# EAGLE design PC_CurveTracer (EAGLE 7.5.0)
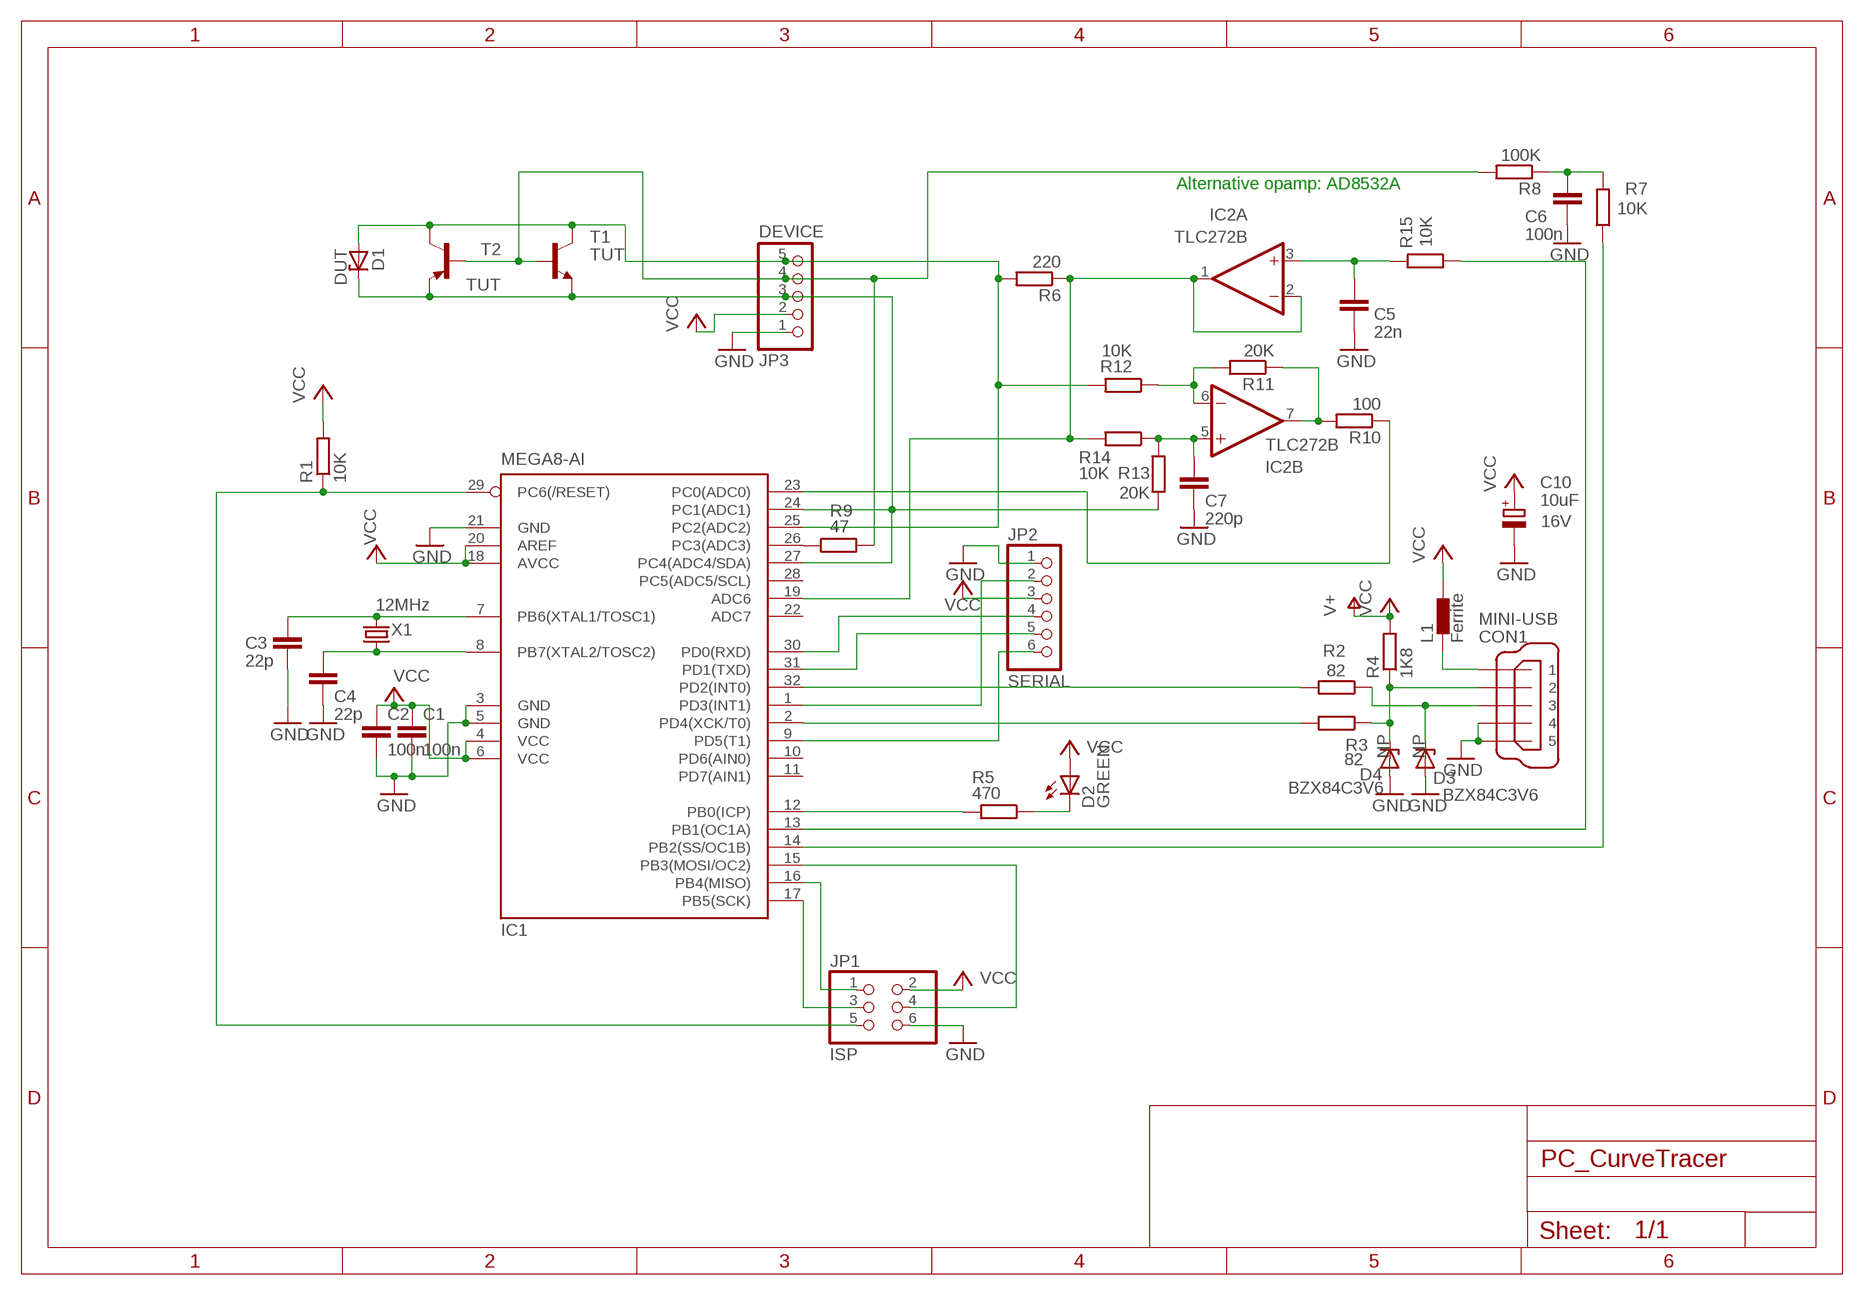
[diagram p0: schematic, sheet 1]

## Parts
C1  100n  C-EUC1206  [C1206]
C2  100n  C-EUC1206  [C1206]
C3  22p  C-EUC0603  [C0603]
C4  22p  C-EUC0603  [C0603]
C5  22n  C-EUC1206  [C1206]
C6  100n  C-EUC1206  [C1206]
C7  220p  C-EUC1206  [C1206]
C10  10uF  CPOL-EUSMCC  [SMC_C]
CON1  MINI-USB  MINI-USB_SHIELD5P4-32005-400  [32005-400]
D1  DUT  ZENER-DIODESOD80C  [SOD80C]
D2  GREEN  LEDSML0805  [SML0805]
D3  BZX84C3V6  BZX84CSMD  [TO236]
D4  BZX84C3V6  BZX84CSMD  [TO236]
IC1  MEGA8-AI  [TQFP32-08]
IC2  TLC272B  LM358D  [SO08]
JP1  ISP  PINHD-2X3  [2X03]
JP2  SERIAL  PINHD-1X6  [1X06]
JP3  DEVICE  PINHD-1X5  [1X05]
L1  Ferrite  BLM15HG601SN1  [0402]
R1  10K  R-EU_R1206  [R1206]
R2  82  R-EU_R1206  [R1206]
R3  82  R-EU_R1206  [R1206]
R4  1K8  R-EU_R1206  [R1206]
R5  470  R-EU_R1206  [R1206]
R6  220  R-EU_R1206  [R1206]
R7  10K  R-EU_R1206  [R1206]
R8  100K  R-EU_R1206  [R1206]
R9  47  R-EU_R1206  [R1206]
R10  100  R-EU_R1206  [R1206]
R11  20K  R-EU_R1206  [R1206]
R12  10K  R-EU_R1206  [R1206]
R13  20K  R-EU_R1206  [R1206]
R14  10K  R-EU_R1206  [R1206]
R15  10K  R-EU_R1206  [R1206]
T1  TUT  BC846  [SOT23]
T2  TUT  -PNP-SOT89-ECB  [SOT89-ECB]
X1  12MHz  CRYSTALHC49S  [HC49/S]

## Nets
GND: C1.2 C2.2 C3.2 C4.2 C5.2 C6.2 C7.2 C10.- CON1.4 CON1.5 D3.A D4.A IC1.3(GND) IC1.5(GND) IC1.21(GND) JP1.6 JP2.1 JP3.1
N$1: IC1.29(PC6(/RESET)) JP1.5 R1.1
N$2: D2.C R5.1
N$3: C3.1 IC1.7(PB6(XTAL1/TOSC1)) X1.2
N$4: C4.1 IC1.8(PB7(XTAL2/TOSC2)) X1.1
N$5: IC1.16(PB4(MISO)) JP1.1
N$6: CON1.1 L1.1
N$7: IC1.15(PB3(MOSI/OC2)) JP1.4
N$8: IC1.12(PB0(ICP)) R5.2
N$9: IC1.32(PD2(INT0)) R2.2
N$10: IC1.1(PD3(INT1)) JP2.2
N$11: CON1.3 D3.C R2.1
N$12: IC1.30(PD0(RXD)) JP2.4
N$13: IC1.2(PD4(XCK/T0)) R3.2
N$14: CON1.2 D4.C R3.1 R4.1
N$15: IC1.13(PB1(OC1A)) R15.1
N$16: C6.1 R7.2 R8.1
N$17: IC2.6(B:-IN) R11.2 R12.1
N$18: IC1.31(PD1(TXD)) JP2.5
N$19: D1.C IC1.24(PC1(ADC1)) IC1.27(PC4(ADC4/SDA)) JP3.3 R13.1 T1.2(E) T2.E
N$21: IC1.9(PD5(T1)) JP2.6
N$22: IC1.23(PC0(ADC0)) R10.1
N$23: IC1.26(PC3(ADC3)) R9.1
N$24: IC1.19(ADC6) IC2.1(A:OUT) IC2.2(A:-IN) R6.1 R14.2
N$25: IC2.7(B:OUT) R10.2 R11.1
N$28: IC1.14(PB2(SS/OC1B)) R7.1
N$33: D1.A IC1.25(PC2(ADC2)) JP3.5 R6.2 R12.2 T1.3(C) T2.C
N$34: C7.1 IC2.5(B:+IN) R13.2 R14.1
N$37: IC1.17(PB5(SCK)) JP1.3
N$41: C5.1 IC2.3(A:+IN) R15.2
TUT: JP3.4 R8.2 R9.2 T1.1(B) T2.B
VCC: C1.1 C2.1 C10.+ D2.A IC1.4(VCC) IC1.6(VCC) IC1.18(AVCC) IC1.20(AREF) JP1.2 JP2.3 JP3.2 L1.2 R1.2 R4.2 ; supply symbol labelled V+
Unconnected: CON1.M1(S1) CON1.M2(S2) CON1.M3(S3) CON1.M4(S4) IC1.10(PD6(AIN0)) IC1.11(PD7(AIN1)) IC1.22(ADC7) IC1.28(PC5(ADC5/SCL))

## Notes on the sheet
- Alternative opamp: AD8532A

## Power pins joined to a net without a drawn wire
GND: IC2.4(P:GND)
VCC: IC2.8(P:VCC)

## Library data of the parts
C1-C7 = rcl:C-EU: CAPACITOR, European symbol
C10 = rcl:CPOL-EU: POLARIZED CAPACITOR, European symbol; VOLTAGE: 16V
CON1 = con-cypressindustries:MINI-USB_SHIELD5P4-: MINI USB-B R/A W/O POST 5 pol. Source: www.cypressindustries.com; OC_FARNELL: unknown; OC_NEWARK: unknown
D1 = diode:ZENER-DIODE: Z-Diode
D2 = led:LED: LED OSRAM: - CHIPLED LG R971, LG N971, LY N971, LG Q971, LY Q971, LO R971, LY R971 LH N974, LH R974 LS Q976, LO Q976, LY Q976 LO Q996 - Hyper CHIPLED LW Q18S LB Q993, LB Q99A, LB R99A - SideLED LS A670, LO A670, LY A670, LG A670, LP A670 LB A673, LV A673, LT A673, LW A673 LH A674 LY A675 LS A676, LA A676, LO A676, LY A676, LW A676 LS A679, LY A679, LG A679 - Hyper Micro SIDELED® LS Y876, LA Y876, LO Y876, LY Y876 LT Y87S - SmartLED LW L88C, LW L88S LB L89C, LB L89S, LG L890 LS L89K, LO L89K, LY L89K LS L896, LA L896, LO L896, LY L896 - TOPLED LS T670, LO T670, LY T670, LG T670, LP T670 LSG T670, LSP T670, LSY T670, LOP T670, LYG T670 LG T671, LOG T671, LSG T671 LB T673, LV T673, LT T673, LW T673 LH T674 LS T676, LA T676, LO T676, LY T676, LB T676, LH T676, LSB T676, LW T676 LB T67C, LV T67C, LT T67C, LS T67K, LO T67K, LY T67K, LW E67C LS E67B, LA E67B, LO E67B, LY E67B, LB E67C, LV E67C, LT E67C LW T67C LS T679, LY T679, LG T679 LS T770, LO T770, LY T770, LG T770, LP T770 LB T773, LV T773, LT T773, LW T773 LH T774 LS E675, LA E675, LY E675, LS T675 LS T776, LA T776, LO T776, LY T776, LB T776 LHGB T686 LT T68C, LB T68C - Hyper Mini TOPLED® LB M676 - Mini TOPLED Santana® LG M470 LS M47K, LO M47K, LY M47K Source: http://www.osram.convergy.de LUXEON: - LUMILED® LXK2-PW12-R00, LXK2-PW12-S00, LXK2-PW14-U00, LXK2-PW14-V00 LXK2-PM12-R00, LXK2-PM12-S00, LXK2-PM14-U00 LXK2-PE12-Q00, LXK2-PE12-R00, LXK2-PE12-S00, LXK2-PE14-T00, LXK2-PE14-U00 LXK2-PB12-K00, LXK2-PB12-L00, LXK2-PB12-M00, LXK2-PB14-N00, LXK2-PB14-P00, LXK2-PB14-Q00 LXK2-PR12-L00, LXK2-PR12-M00, LXK2-PR14-Q00, LXK2-PR14-R00 LXK2-PD12-Q00, LXK2-PD12-R00, LXK2-PD12-S00 LXK2-PH12-R00, LXK2-PH12-S00 LXK2-PL12-P00, LXK2-PL12-Q00, LXK2-PL12-R00 Source: www.luxeon.com KINGBRIGHT: KA-3528ASYC Source: www.kingbright.com
D3 D4 = diode:BZX84CSMD: Z DIODE; NP: NP
IC1 = atmel:MEGA8: MICROCONTROLLER 8 Kbytes FLASH, 1 kbytes SRAM, 512 bytes EEPROM, USART, 6-channel 10 bit ADC, 2-channel 8 bit ADC Pin compatible with Atmega48, ATMega88, ATMega168 Source: avr.lbr; MPN: ATMEGA8-16AU; OC_FARNELL: 9171371; OC_NEWARK: 73M8863
IC2 = linear3:LM358: OP AMP also LM158; LM258; LM2904 Source: http://cache.national.com/ds/LM/LM158.pdf
JP1 = pinhead:PINHD-2X3: PIN HEADER
JP2 = pinhead:PINHD-1X6: PIN HEADER
JP3 = pinhead:PINHD-1X5: PIN HEADER
L1 = inductors:BLM15H: EMIFIL (R) Chip Ferrite Bead for GHz Noise Source: http://www.murata.com/ Ferrite Bead BLM15H.pdf
R1-R15 = rcl:R-EU_: RESISTOR, European symbol
T1 = transistor:BC846: NPN TRANSISTOR
T2 = transistor:*-PNP-: PNP Transistror
X1 = crystal:CRYSTAL: CRYSTAL; OC_FARNELL: 1667008; OC_NEWARK: unknown

## Net classes
0 default: clearance 0.205 mm

## Board
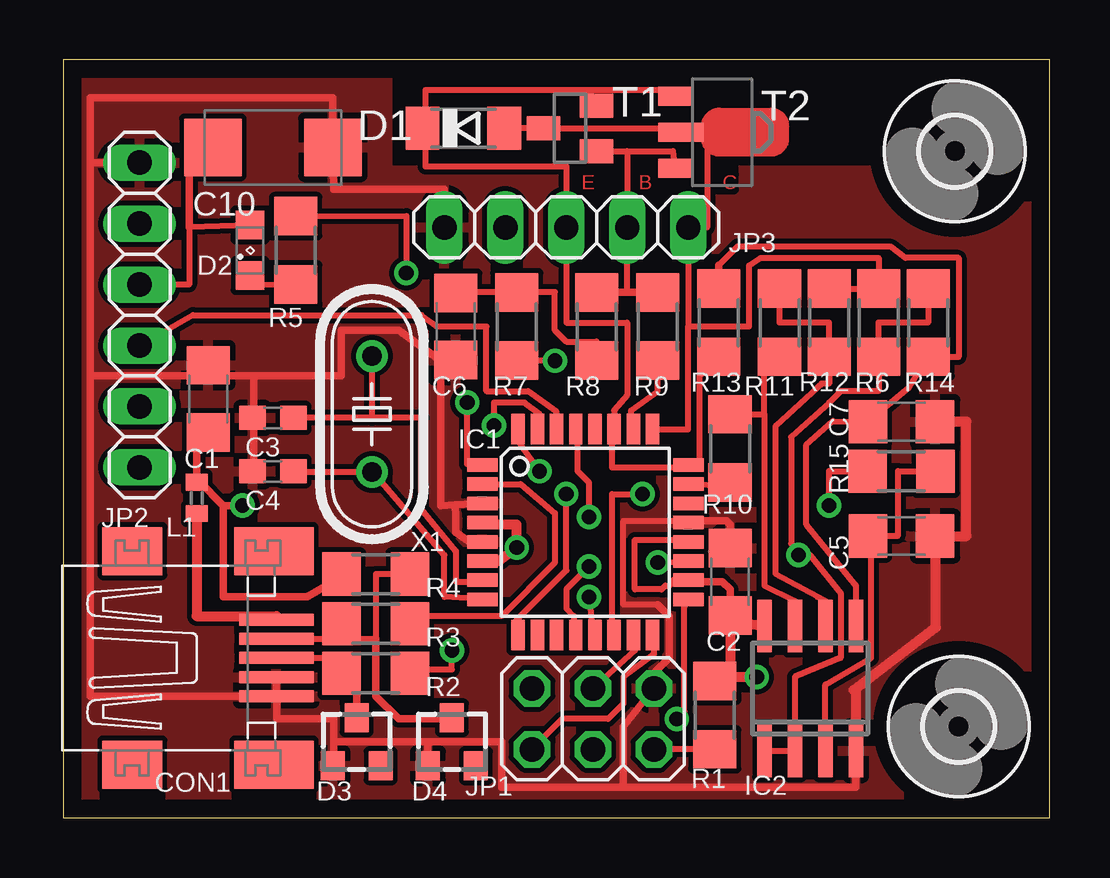
[diagram p1: board, top side]
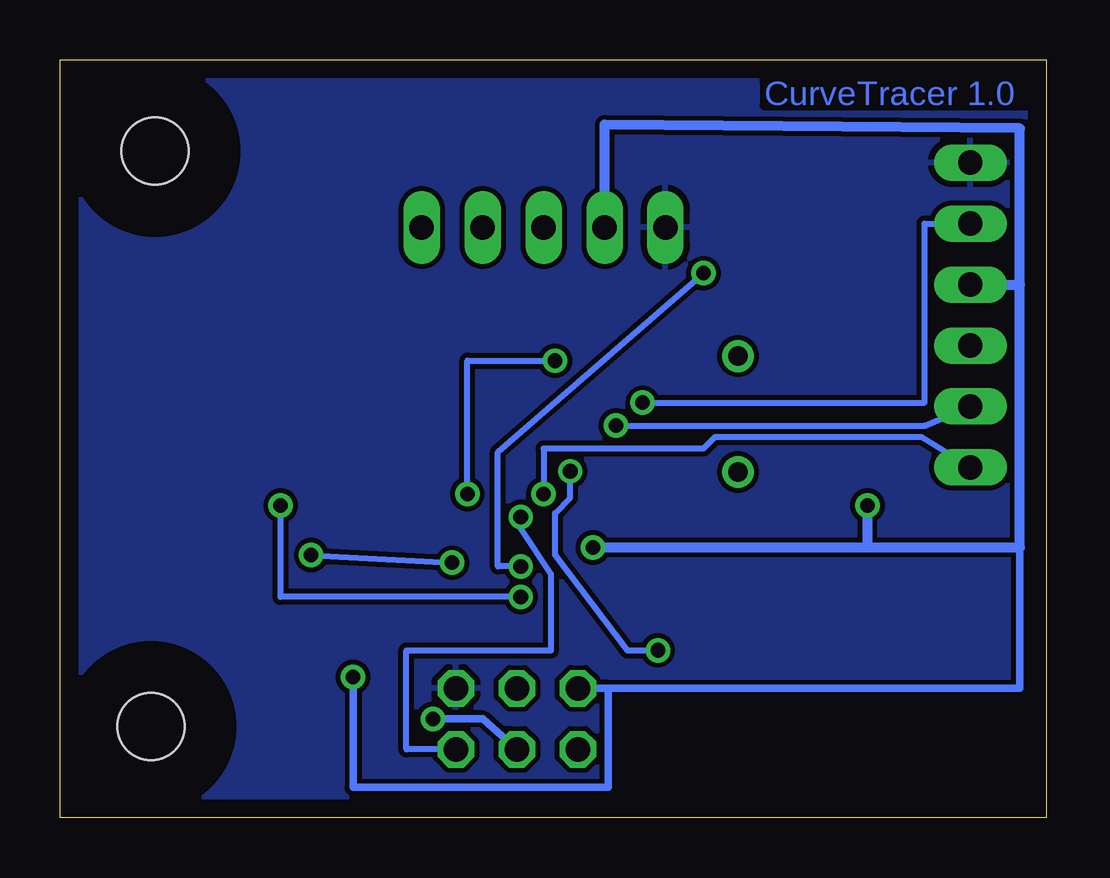
[diagram p2: board, bottom side, seen from below]

Size 41.1 x 31.58 mm. Coordinates in mm from the lower left corner, seen from the top.
Outline: 0,0 41.1,0 41.1,31.58 0,31.58 0,0
Copper layers (1*16): Top 0.035mm / dielectric 1.5mm / Bottom 0.035mm
Design rules "default *": minimum track width 8mil, minimum drill 24mil, track to track 8mil, track to pad 8mil, pad to pad 8mil, via to via 8mil, smd to smd 8mil, copper to edge 30mil, drill to drill 8mil, minimum pad ring 10mil, minimum via ring 8mil, stop-mask expansion 4mil, vias tented up to drill 0mil, thermal gap 10mil

### Footprints (pad centres in the part's own frame; a part is rotated, then mirrored left to right if it is on the bottom)
C1206 = smd 1.6 x 1.8: 1 -1.4,0; 2 1.4,0
C0603 = smd 1.1 x 1: 1 -0.85,0; 2 0.85,0
SMC_C = smd 2.4 x 2.4: + -2.5,0; - 2.5,0
32005-400 = smd 3.1 x 0.5: 1 3,1.6; 2 3,0.8; 3 3,0; 4 3,-0.8; 5 3,-1.6 | smd 2.5 x 2: M1 -3,-4.45; M2 -3,4.45 | smd 3.3 x 2: M3 2.9,4.45; M4 2.9,-4.45
SOD80C = smd 1.4 x 1.8: A 1.7,0; C -1.7,0
SML0805 = smd 1.2 x 1.2: A 1.05,0; C -1.05,0
TO236 = smd 1 x 1.2: A -1,-1; C 0,1; NC 1,-1
2,8 = hole 2.8: 0,0
TQFP32-08 = smd 1.27 x 0.559: 1 -4.293,2.8; 2 -4.293,2; 3 -4.293,1.2; 4 -4.293,0.4; 5 -4.293,-0.4; 6 -4.293,-1.2; 7 -4.293,-2; 8 -4.293,-2.8; 17 4.293,-2.8; 18 4.293,-2; 19 4.293,-1.2; 20 4.293,-0.4; 21 4.293,0.4; 22 4.293,1.2; 23 4.293,2; 24 4.293,2.8 | smd 0.559 x 1.27: 9 -2.8,-4.293; 10 -2,-4.293; 11 -1.2,-4.293; 12 -0.4,-4.293; 13 0.4,-4.293; 14 1.2,-4.293; 15 2,-4.293; 16 2.8,-4.293; 25 2.8,4.293; 26 2,4.293; 27 1.2,4.293; 28 0.4,4.293; 29 -0.4,4.293; 30 -1.2,4.293; 31 -2,4.293; 32 -2.8,4.293
SO08 = smd 0.6 x 2.2: 1 -1.905,-2.6; 2 -0.635,-2.6; 3 0.635,-2.6; 4 1.905,-2.6; 5 1.905,2.6; 6 0.635,2.6; 7 -0.635,2.6; 8 -1.905,2.6
2X03 = drill 1.016 octagon: 1 -2.54,-1.27; 2 -2.54,1.27; 3 0,-1.27; 4 0,1.27; 5 2.54,-1.27; 6 2.54,1.27
1X06 = drill 1.016 long: 1 -6.35,0; 2 -3.81,0; 3 -1.27,0; 4 1.27,0; 5 3.81,0; 6 6.35,0
1X05 = drill 1.016 long: 1 -5.08,0; 2 -2.54,0; 3 0,0; 4 2.54,0; 5 5.08,0
0402 = smd 0.7 x 0.9: 1 -0.65,0; 2 0.65,0
R1206 = smd 1.6 x 1.803: 1 -1.422,0; 2 1.422,0
SOT23 = smd 1 x 1.4: 1 -0.95,-1.1; 2 0.95,-1.1; 3 0,1.1
SOT89-ECB = smd 0.8 x 1.4: B 1.499,-1.981; E -1.499,-1.981 | smd 0.8 x 1.9: C 0,-1.727
HC49/S = drill 0.813: 1 -2.413,0; 2 2.413,0

### Placement (x,y rotation side)
C1  6.03,17.46 90 top
C2  27.78,9.84 90 top
C3  8.73,16.67 180 top
C4  8.73,14.45 180 top
C5  34.92,11.75 0 top
C6  16.35,20.48 270 top
C7  34.92,16.51 0 top
C10  8.73,27.94 0 top
CON1  5.87,6.67 0 top
D1  16.67,28.73 0 top
D2  7.78,23.65 90 top
D3  12.22,3.17 0 top
D4  16.19,3.17 0 top
HOLE1  -  [2,8]  37.15,27.78 0 top
HOLE2  -  [2,8]  37.31,3.81 0 top
IC1  21.75,11.91 0 top
IC2  31.12,5.4 0 top
JP1  22.07,4.13 0 top
JP2  3.18,20.95 270 top
JP3  20.96,24.61 0 top
L1  5.56,13.34 90 top
R1  27.15,4.29 90 top
R2  13.02,6.03 0 top
R3  13.02,8.1 0 top
R4  13.02,10.16 180 top
R5  9.68,23.65 90 top
R6  33.97,20.64 90 top
R7  18.89,20.48 90 top
R8  22.23,20.48 90 top
R9  24.77,20.48 90 top
R10  27.78,15.4 90 top
R11  29.85,20.64 90 top
R12  31.91,20.64 90 top
R13  27.3,20.64 90 top
R14  36.04,20.64 90 top
R15  34.92,14.45 0 top
T1  21.11,28.73 90 top
T2  27.46,28.57 270 top
X1  12.86,16.83 90 top

### Tracks (layer width: path | path; a pad name or v marks a point on that pad's centre or on a via)
GND
  Top 0.254: 24.76,8.89 23.34,8.89 23.34,12.38 25.97,12.38
  Top 0.305: CON1.4 CON1.5 1.11,5.08 1.11,18.41 | 8.89,5.07 8.89,4.13 11.27,4.13 11.27,3.17 | 11.27,2.06 11.27,3.17 | 11.27,3.17 15.19,3.17 | 15.19,3.17 D4.A | IC1.5 16.91,11.51 16.35,11.91 16.35,12.54 16.33,13.05 | 17.37,13.02 IC1.3 16.33,13.05 | 23.34,1.27 18.26,1.27 18.26,3.17 15.19,3.17 | 23.34,1.27 23.34,3.81 JP1.6 24.61,6.03 25.24,6.67 25.24,8.41 24.76,8.89 | 1.11,27.3 1.11,30 11.23,30 C10.- 11.27,26.19 15.87,26.19 JP3.1 | 1.11,27.3 1.11,18.41 | 7.94,18.41 6.03,18.41 | 6.03,18.41 1.11,18.41 | IC2.4 33.02,1.27 23.34,1.27 | 15.72,19.05 13.97,20.32 11.59,20.32 11.59,18.41 7.94,18.41 | C6.2 15.72,19.05 | 15.72,19.05 15.72,13.02 16.33,13.05 | 25.97,12.38 IC1.21 26.12,12.38 27.62,12.38 27.78,12.22 C2.2 | C4.2 7.94,14.45 7.94,18.41 | C1.2 6.03,18.41 | JP2.1 1.11,27.3
  Top 0.406: CON1.5 8.89,5.07 | D3.A 11.54,2.06 11.27,2.06 | IC2.4 33.02,5.4 32.93,5.32 36.35,7.94 36.35,11.75 | C5.2 36.35,11.75 | 36.35,11.75 37.62,11.75 37.62,16.51 C7.2
  pour Top: 41.12,0 -0.48,-0.16 -0.32,0 0,31.59 13.49,31.59 13.49,26.99 41.12,26.99
  pour Bottom: -0.32,-0.16 -0.32,31.59 41.12,31.59 41.12,0
N$1  (via drill 0.61)
  Top 0.254: R1.1 JP1.5 | v21.91,12.54 21.91,13.97 21.43,14.45 21.43,16.12 IC1.29 | R1.1 JP1.5
  Top 0.305: R1.1
  Bottom 0.254: JP1.5 26.67,2.86 26.67,6.99 20.64,6.99 20.64,10.16 21.91,12.06 v21.91,12.54
N$2
  Top 0.254: D2.C 7.79,22.23 R5.1
N$3
  Top 0.254: 12.86,16.67 14.92,16.67 14.92,12.86 16.35,11.11 16.35,9.84 17.46,9.84 IC1.7 | X1.2 12.86,16.67 | 12.86,16.67 C3.1
N$4
  Top 0.254: 9.61,14.41 X1.1 13.02,14.29 15.87,10.95 15.87,9.21 IC1.8
  Top 0.406: 9.61,14.41 C4.1
N$5
  Top 0.254: IC1.16 24.61,6.83 23.34,5.87 23.34,4.76 22.7,4.13 20.8,4.13 JP1.1
N$6
  Top 0.406: L1.1 5.56,8.41 8.87,8.41 CON1.1
N$7
  Top 0.254: IC1.15 23.81,6.99 JP1.4
N$8  (via drill 0.61)
  Top 0.254: v21.91,10.48 20.96,9.53 20.96,8.73 21.27,8.41 21.27,7.69 IC1.12 | R5.2 14.29,25.08 v14.29,22.7
  Bottom 0.254: v14.29,22.7 22.86,15.24 22.86,10.48 v21.91,10.48
N$9  (via drill 0.61)
  Top 0.254: R2.2 13.81,6.34 14.13,6.19 16.19,6.19 v16.19,6.99 | v19.84,14.45 19.05,15.56 IC1.32
  Bottom 0.254: v19.84,14.45 19.84,13.34 20.48,12.7 20.48,10.95 17.46,6.99 v16.19,6.99
N$10  (via drill 0.61)
  Top 0.254: IC1.1 16.82,14.76 v16.83,17.3
  Bottom 0.254: v16.83,17.3 5.08,17.3 5.08,24.77 JP2.2
N$11
  Top 0.254: CON1.3 10.96,6.67 R2.1
  Top 0.305: D3.C 12.22,6.03 R2.1
N$12
  Top 0.254: IC1.30 20.55,16.92 19.37,17.78 17.62,17.78 17.62,20.48 15.56,20.48 14.92,20.95 5.4,20.95 JP2.4
N$13
  Top 0.254: IC1.2 19.05,13.91 20.48,12.7 20.48,10.64 18.26,8.41 14.44,8.41 R3.2
N$14
  Top 0.254: CON1.2 10.01,7.47 10.16,7.46 11.27,7.46 | 11.27,7.46 13.02,7.46 13.02,10.16 R4.1 | R3.1 11.27,7.94 11.27,7.46
  Top 0.305: 13.02,7.46 13.02,5.08 13.97,4.13 16.14,4.13 D4.C
N$15  (via drill 0.61)
  Top 0.254: v21.91,9.21 22.07,7.69 IC1.13 | v31.91,13.02 31.91,14.45 R15.1
  Bottom 0.254: v31.91,13.02 31.91,9.21 v21.91,9.21
N$16
  Top 0.254: R8.1 22.22,19.84 20.96,19.84 20.48,20.32 20.48,21.91 R7.2 16.35,21.9 C6.1
N$17
  Top 0.254: R11.2 29.85,20.64 31.91,20.64 R12.1 | IC2.6 31.75,9.05 31.43,9.21 29.69,10.16 29.69,16.35 31.43,17.94 31.59,18.1 31.91,18.1 R12.1 | R12.1 31.59,19.21
N$18  (via drill 0.61)
  Top 0.254: IC1.31 19.84,16.83 19.21,17.3 17.94,17.3 v17.94,16.35
  Bottom 0.254: v17.94,16.35 5.08,16.35 JP2.5
N$19
  Top 0.254: 14.76,29.38 D1.C 15.08,29.37 | T2.E 25.56,30.32 21.91,30.32 | 21.91,30.32 15.08,30.32 15.08,29.37 | 15.08,29.37 15.08,27.15 20.96,27.15 JP3.3 20.96,20.64 23.49,20.64 23.49,17.62 22.95,16.99 IC1.27 | 22.86,16.19 IC1.27 | T1.2 21.91,30.32 | IC1.27 22.86,16.2 22.86,16.19 | 22.86,16.19 22.86,14.61 26.04,14.61 IC1.24 26.51,14.71 26.51,18.42 R13.1
N$21  (via drill 0.61)
  Top 0.254: IC1.9 18.89,8.26 20.96,10.32 v20.96,13.49
  Bottom 0.254: v20.96,13.49 20.96,15.4 14.29,15.4 13.81,15.88 5.24,15.88 JP2.6
N$22
  Top 0.254: R10.1 27.62,13.81 IC1.23
N$23
  Top 0.254: IC1.26 23.65,16.2 23.65,16.99 24.76,17.78 R9.1
N$24  (via drill 0.61)
  Top 0.254: IC2.1 IC2.2 30.48,5.87 32.39,6.67 32.39,9.37 31.12,10.95 v30.64,10.95 30.32,11.43 30.32,15.88 31.91,17.3 32.39,17.78 33.97,17.78 R6.1 33.97,20.64 36.04,20.64 R14.2 | v24.76,10.64 IC1.19
  Bottom 0.254: v30.64,10.95 v24.76,10.64
N$25
  Top 0.254: IC2.7 30.48,9.05 29.21,9.68 29.21,16.82 | R10.2 29.21,16.82 | 29.21,16.82 29.21,18.57 29.05,18.57 R11.1
N$28  (via drill 0.61)
  Top 0.254: IC1.14 22.86,8.16 22.86,13.49 v24.13,13.49 | v20.48,19.05 R7.1
  Bottom 0.254: v24.13,13.49 24.13,19.05 v20.48,19.05
N$33
  Top 0.254: D1.A T1.3 25.58,28.73 T2.C 26.83,28.57 26.83,24.61 JP3.5 26.03,20.48 | 26.03,20.48 28.57,20.48 28.57,23.02 29.05,23.34 33.97,23.34 R6.2 R12.2 | IC1.25 24.61,16.19 26.03,16.19 26.03,20.48
N$34
  Top 0.254: R14.1 37.31,19.21 37.31,23.34 35.08,23.34 34.45,23.81 28.1,23.81 27.3,23.02 | 35.4,18.9 R14.1 | IC2.5 33.02,9.68 30.96,12.22 30.96,15.56 32.07,16.54 C7.1 35.24,17.94 R14.1
  Top 0.305: 27.3,23.02 R13.2
N$37  (via drill 0.61)
  Top 0.254: v25.56,4.13 25.88,4.45 25.88,8.78 IC1.17
  Bottom 0.305: 22.07,2.7 JP1.3 23.49,4.13 v25.56,4.13
N$41
  Top 0.254: IC2.3 31.75,5.56 33.65,6.67 33.65,11.75 | R15.2 34.77,14.45 34.77,11.75 33.65,11.75 | C5.1 33.65,11.75
TUT
  Top 0.254: R9.2 23.81,21.91 23.49,21.91 JP3.4 23.49,27.78 | T1.1 23.49,27.78 | 23.49,27.78 25.4,27.78 T2.B
  Top 0.305: R8.2 23.81,21.91
VCC  (via drill 0.61)
  Top 0.254: D2.A 5.24,24.61 5.24,22.23 JP2.3 | 25.97,11.59 23.81,11.59 23.81,9.53 24.92,9.53 25.08,9.68 25.24,9.68 25.46,9.91
  Top 0.305: R4.2 11.6,9.69 11.59,9.68 10.95,9.68 10.16,9.21 6.67,9.21 6.67,13.02 | 6.67,13.02 v7.46,13.02 | C1.1 5.69,15.4 5.56,15.4 5.56,14.13 5.64,14.05 | 5.64,14.05 6.67,13.02 | L1.2 5.57,13.98 5.64,14.05 | C2.1 27.78,9.53 27.46,9.84 26.11,9.84 IC1.18 25.46,9.91 | 25.97,11.59 IC1.20 | C10.+ 5.24,27.94 5.24,24.61
  Top 0.406: IC1.6 18.17,10.71 v18.89,11.27 18.89,12.22 17.54,12.22 IC1.4 | 5.56,15.72 5.56,15.4 | C2.1 27.78,8.26 | 27.78,8.26 27.78,5.87 | 27.15,5.4 R1.2 27.14,5.87 27.78,5.87 | IC2.8 27.88,8.16 27.78,8.26 | 27.78,5.87 v28.89,5.87
  Bottom 0.305: 18.26,5.4 18.26,1.27 28.89,1.27 v28.89,5.87 | 18.26,5.4 JP1.2 | 18.26,5.4 1.11,5.4 1.11,11.27
  Bottom 0.406: v18.89,11.27 7.46,11.27 | 7.46,11.27 1.11,11.27 1.11,22.23 | JP2.3 1.11,22.23 | 1.11,22.23 1.11,28.73 18.42,28.89 JP3.2 | v7.46,13.02 7.46,11.27

### Text on the board
Top: E | B | C
Bottom: CurveTracer 1.0